# EAGLE design 246_PWM(PCA9685) (EAGLE 9.6.2)
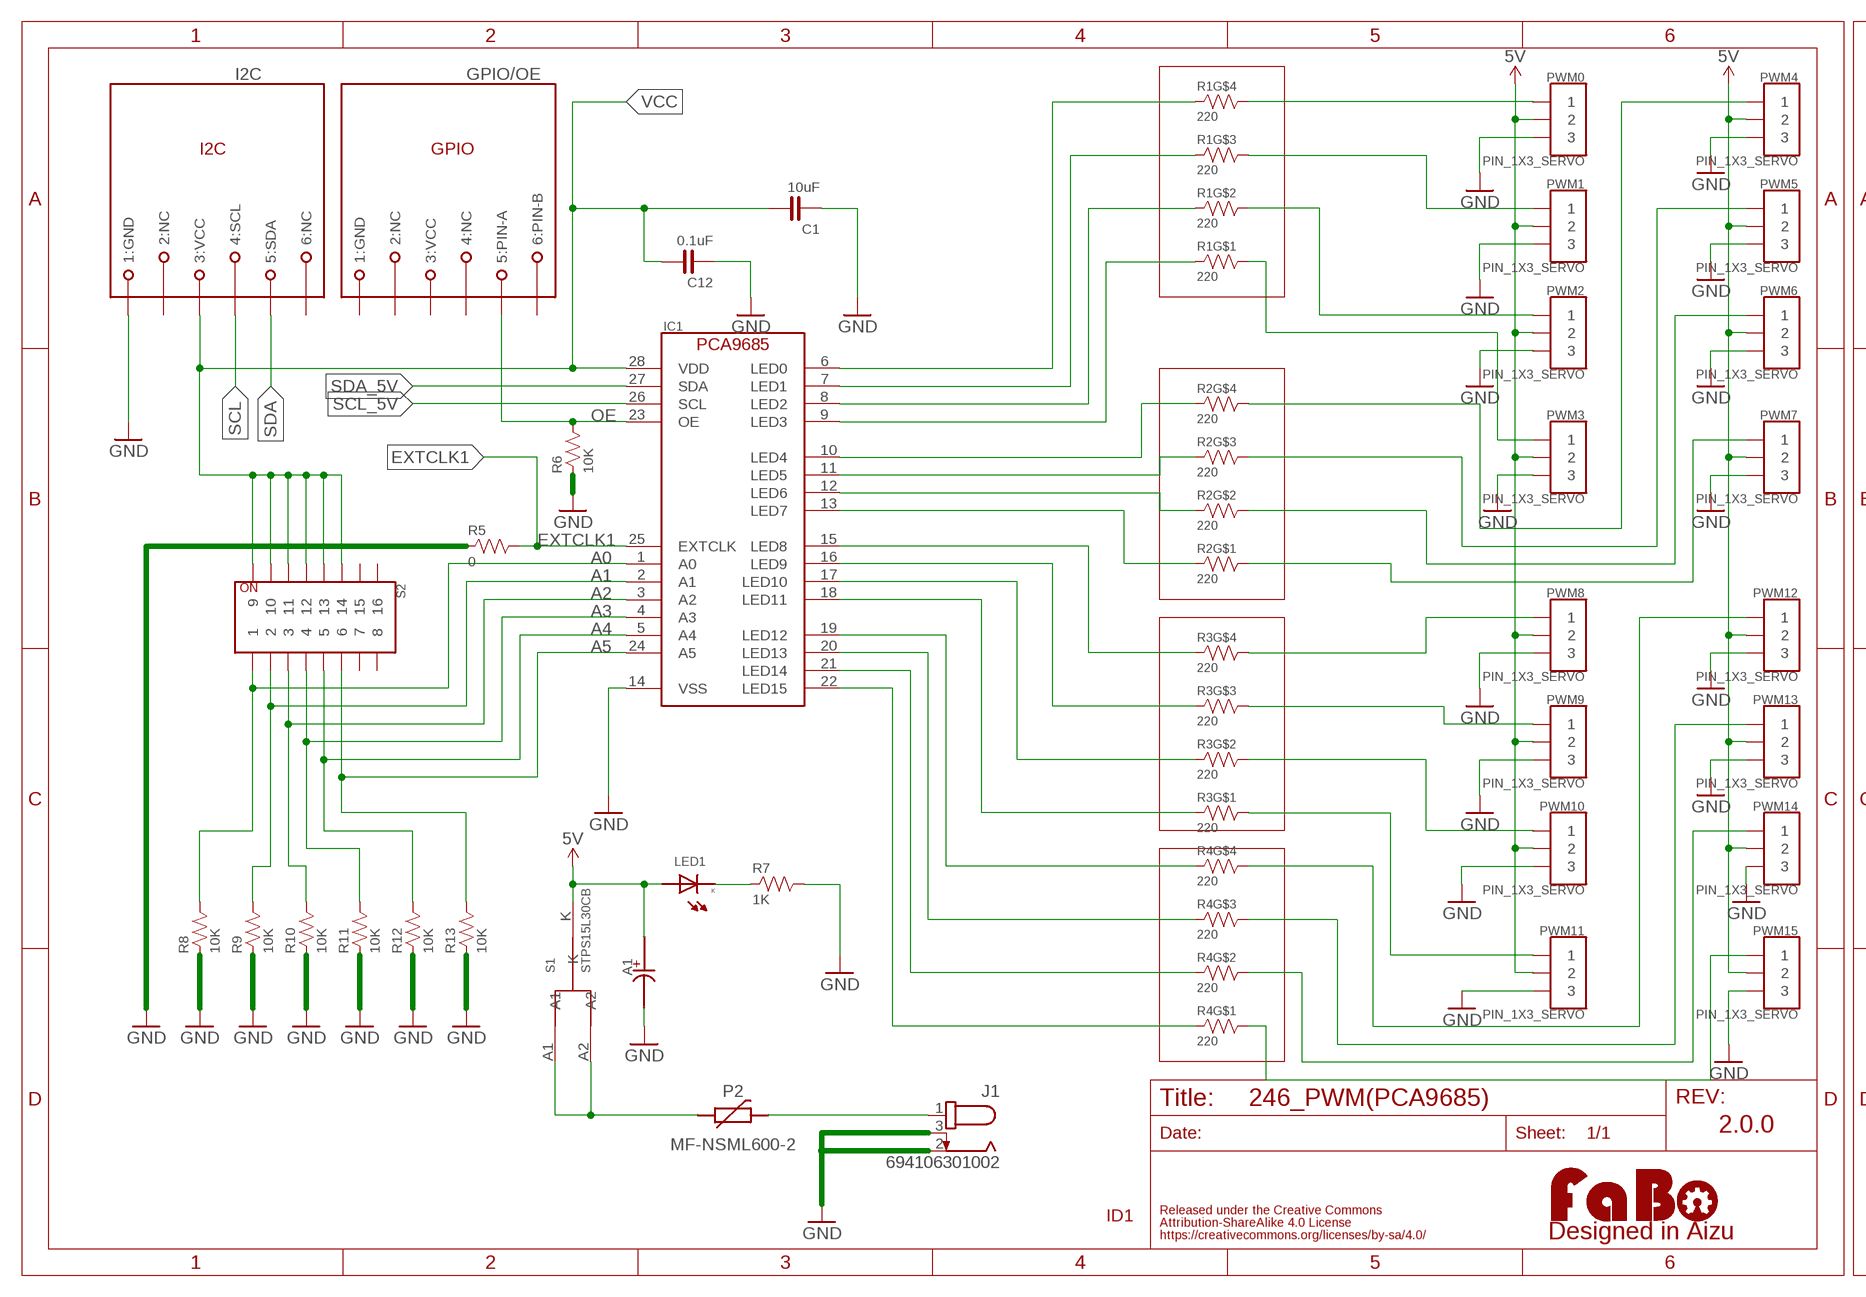
[diagram p0: schematic, sheet 1, part 1 of 2]
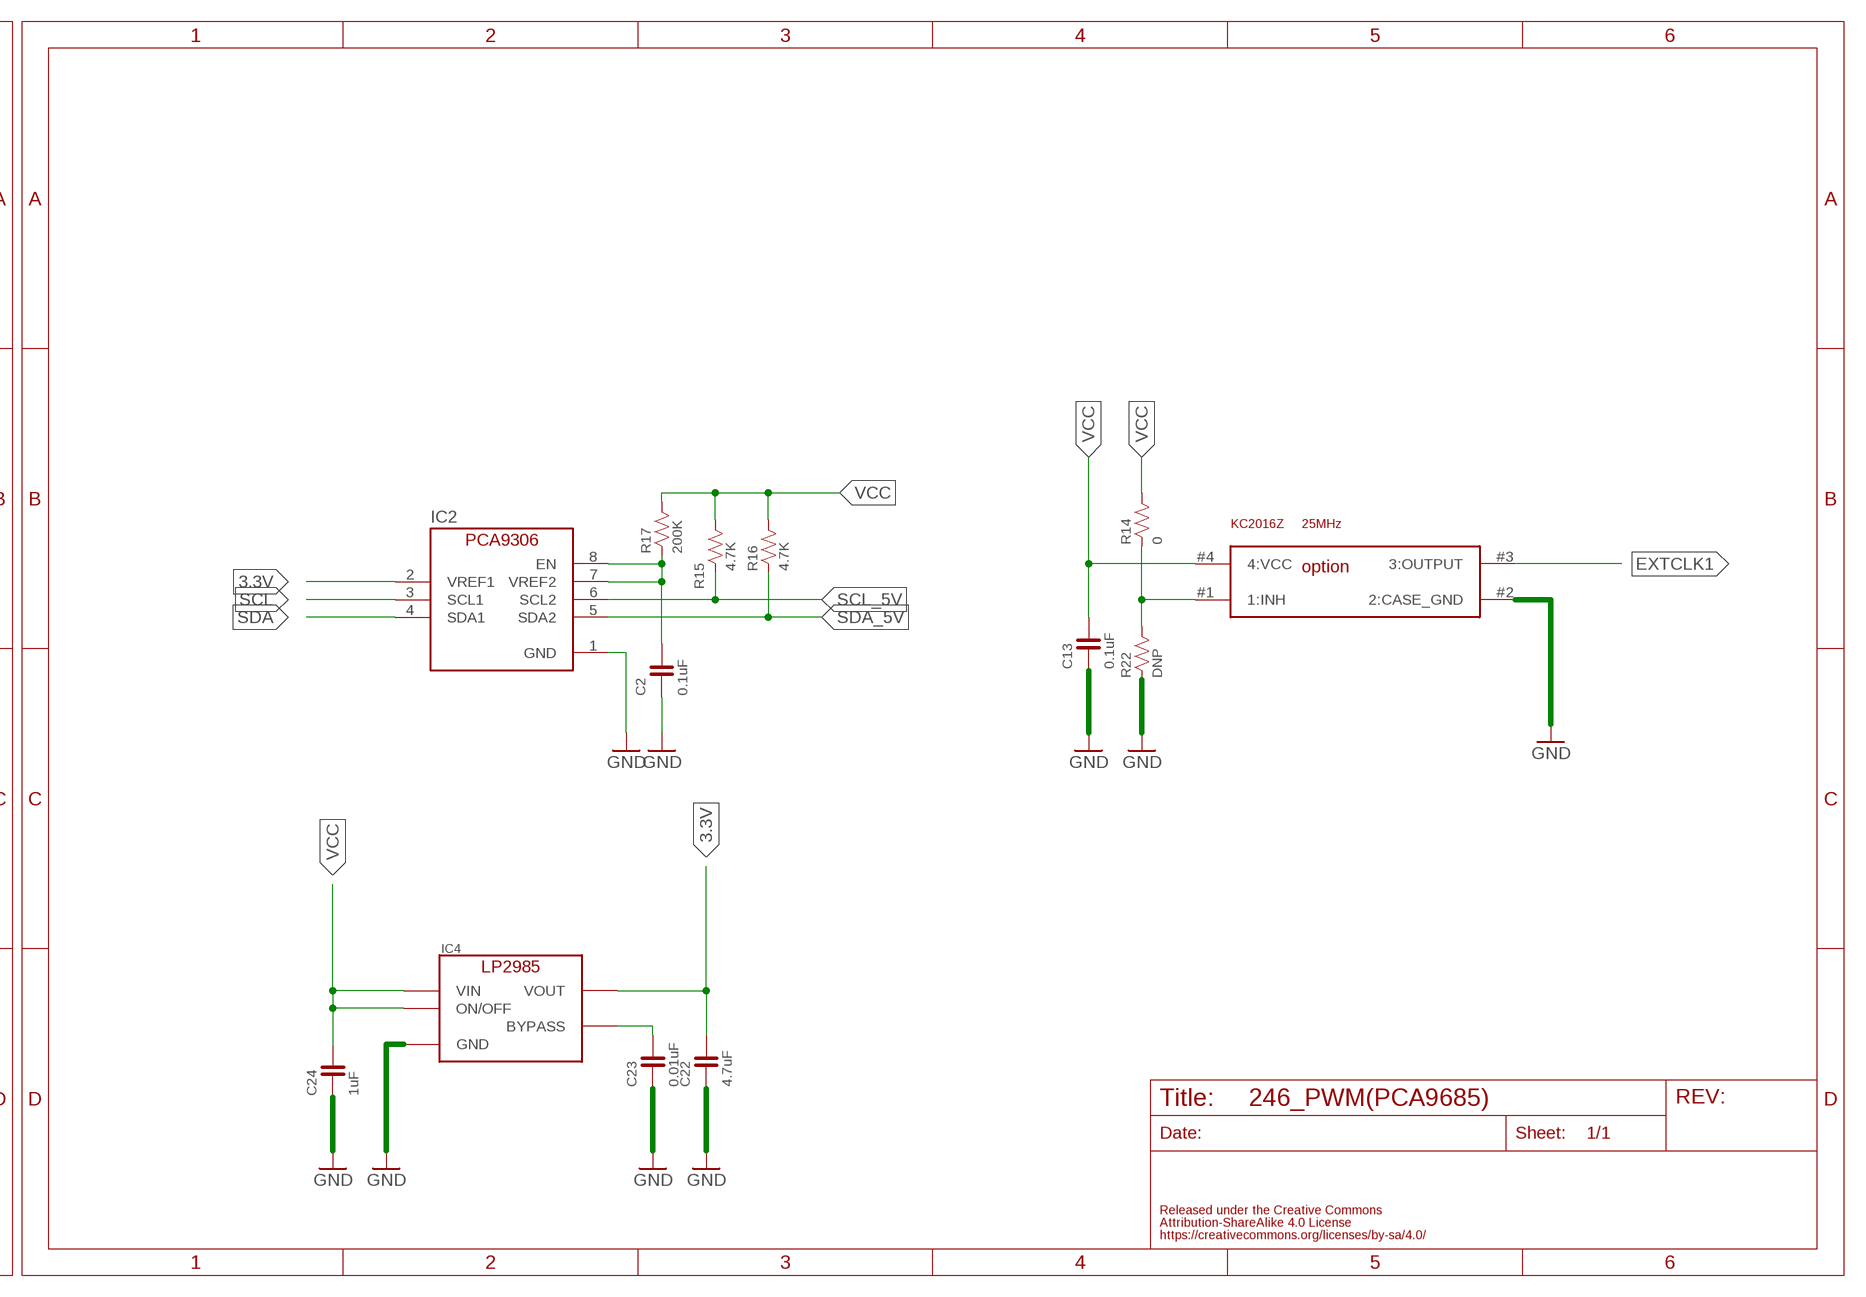
[diagram p1: schematic, sheet 1, part 2 of 2]

## Parts
A1  CAPACITOR-OS-CON  [F13]
C1  10uF  CAPACITOR-0603  [0603]
C2  0.1uF  CAPACITOR-0402  [0402]
C12  0.1uF  CAPACITOR-0603  [0603]
C13  0.1uF  CAPACITOR-0402  [0402]
C22  4.7uF  CAPACITOR-0603  [0603]
C23  0.01uF  CAPACITOR-0603  [0603]
C24  1uF  CAPACITOR-0603  [0603]
GPIO/OE  MODULAR-JACK-6P-RJ11_GPIO  [7002-6PXC-X]
I2C  MODULAR-JACK-6P-RJ11_I2C  [7002-6PXC-X]
IC1  PCA9685BS  [PCA9685]
IC2  PCA9306_GM  [XQFN8]
IC4  LP2985-33DBV  [SOT-23-5]
J1  694106301002  [694106301002]
LED1  LED-0603  [0603]
LOGO1  LOGO_FABO-M_BOTTOM  [LOGO_FABO_M_BOTTOM]
P2  MF-NSML600-2  POLYSWITCH1206  [1206]
PWM0  PIN_1X3_SERVO  [PIN_1X3_NOLABEL_PWM]
PWM1  PIN_1X3_SERVO  [PIN_1X3_NOLABEL_PWM]
PWM2  PIN_1X3_SERVO  [PIN_1X3_NOLABEL_PWM]
PWM3  PIN_1X3_SERVO  [PIN_1X3_NOLABEL_PWM]
PWM4  PIN_1X3_SERVO  [PIN_1X3_NOLABEL_PWM]
PWM5  PIN_1X3_SERVO  [PIN_1X3_NOLABEL_PWM]
PWM6  PIN_1X3_SERVO  [PIN_1X3_NOLABEL_PWM]
PWM7  PIN_1X3_SERVO  [PIN_1X3_NOLABEL_PWM]
PWM8  PIN_1X3_SERVO  [PIN_1X3_NOLABEL_PWM]
PWM9  PIN_1X3_SERVO  [PIN_1X3_NOLABEL_PWM]
PWM10  PIN_1X3_SERVO  [PIN_1X3_NOLABEL_PWM]
PWM11  PIN_1X3_SERVO  [PIN_1X3_NOLABEL_PWM]
PWM12  PIN_1X3_SERVO  [PIN_1X3_NOLABEL_PWM]
PWM13  PIN_1X3_SERVO  [PIN_1X3_NOLABEL_PWM]
PWM14  PIN_1X3_SERVO  [PIN_1X3_NOLABEL_PWM]
PWM15  PIN_1X3_SERVO  [PIN_1X3_NOLABEL_PWM]
R1  220  RESISTOR_ARRAY  [EXBV8V]
R2  220  RESISTOR_ARRAY  [EXBV8V]
R3  220  RESISTOR_ARRAY  [EXBV8V]
R4  220  RESISTOR_ARRAY  [EXBV8V]
R5  0  RESISTOR-0603  [0603]
R6  10K  RESISTOR-0603  [0603]
R7  1K  RESISTOR-0603  [0603]
R8  10K  RESISTOR-0603  [0603]
R9  10K  RESISTOR-0603  [0603]
R10  10K  RESISTOR-0603  [0603]
R11  10K  RESISTOR-0603  [0603]
R12  10K  RESISTOR-0603  [0603]
R13  10K  RESISTOR-0603  [0603]
R14  0  RESISTOR-0402  [0402]
R15  4.7K  RESISTOR-0402  [0402]
R16  4.7K  RESISTOR-0402  [0402]
R17  200K  RESISTOR-0402  [0402]
R22  DNP  RESISTOR-0402  [0402]
S1  STPS15L30CB  STPS15L30C  [STPS15L30C]
S2  KHS82  [KHS82]
U$11  KC2016Z  [KC2016Z]

## Nets
3.3V: C22.2 IC2.2(VREF1) IC4.5(VOUT)
5V: A1.ANODE(+) LED1.ANODE PWM0.2:VCC PWM1.2:VCC PWM2.2:VCC PWM3.2:VCC PWM4.2:VCC PWM5.2:VCC PWM6.2:VCC PWM7.2:VCC PWM8.2:VCC PWM9.2:VCC PWM10.2:VCC PWM11.2:VCC PWM12.2:VCC PWM13.2:VCC PWM14.2:VCC PWM15.2:VCC S1.K
A0: IC1.1(A0) R8.2 S2.1
A1: IC1.2(A1) R9.2 S2.2
A2: IC1.3(A2) R10.2 S2.3
A3: IC1.4(A3) R11.2 S2.4
A4: IC1.5(A4) R12.2 S2.5
A5: IC1.24(A5) R13.2 S2.6
EXTCLK1: IC1.25(EXTCLK) R5.2 U$11.#3(3:OUTPUT)
GND: A1.CATHODE(-) C1.1 C2.P$1 C12.1 C13.P$1 C22.1 C23.1 C24.1 I2C.1(1:GND) IC1.14(VSS) IC2.1(GND) IC4.2(GND) J1.2 J1.3 PWM0.3:GND PWM1.3:GND PWM2.3:GND PWM3.3:GND PWM4.3:GND PWM5.3:GND PWM6.3:GND PWM7.3:GND PWM8.3:GND PWM9.3:GND PWM10.3:GND PWM11.3:GND PWM12.3:GND PWM13.3:GND PWM14.3:GND PWM15.3:GND R5.1 R6.1 R7.2 R8.1 R9.1 R10.1 R11.1 R12.1 R13.1 R22.P$1 U$11.#2(2:CASE_GND)
N$1: IC1.6(LED0) R1.4
N$2: IC1.7(LED1) R1.3
N$3: IC1.8(LED2) R1.2
N$4: IC1.9(LED3) R1.1
N$5: PWM0.1:SIGNAL R1.5
N$6: PWM1.1:SIGNAL R1.6
N$7: PWM2.1:SIGNAL R1.7
N$8: PWM3.1:SIGNAL R1.8
N$9: IC1.10(LED4) R2.4
N$10: IC1.11(LED5) R2.3
N$11: IC1.12(LED6) R2.2
N$12: IC1.13(LED7) R2.1
N$13: IC1.15(LED8) R3.4
N$14: IC1.16(LED9) R3.3
N$15: IC1.17(LED10) R3.2
N$16: IC1.18(LED11) R3.1
N$17: IC1.19(LED12) R4.4
N$18: IC1.20(LED13) R4.3
N$19: IC1.21(LED14) R4.2
N$20: IC1.22(LED15) R4.1
N$21: PWM4.1:SIGNAL R2.5
N$22: PWM5.1:SIGNAL R2.6
N$23: PWM6.1:SIGNAL R2.7
N$24: PWM7.1:SIGNAL R2.8
N$25: PWM8.1:SIGNAL R3.5
N$26: PWM9.1:SIGNAL R3.6
N$27: PWM10.1:SIGNAL R3.7
N$28: PWM11.1:SIGNAL R3.8
N$29: PWM12.1:SIGNAL R4.5
N$30: PWM13.1:SIGNAL R4.6
N$31: PWM14.1:SIGNAL R4.7
N$32: PWM15.1:SIGNAL R4.8
N$33: P2.P$1 S1.A1 S1.A2
N$37: C23.2 IC4.4(BYPASS)
N$39: LED1.CATHODE R7.1
N$50: R14.P$1 R22.P$2 U$11.#1(1:INH)
OE: GPIO/OE.5(5:PIN-A) IC1.23(OE) R6.2
PTCP1: J1.1 P2.P$2
SCL: I2C.4(4:SCL) IC2.3(SCL1)
SCL_5V: IC1.26(SCL) IC2.6(SCL2) R15.P$1
SDA: I2C.5(5:SDA) IC2.4(SDA1)
SDA_5V: IC1.27(SDA) IC2.5(SDA2) R16.P$1
VCC: C1.2 C12.2 C13.P$2 C24.2 I2C.3(3:VCC) IC1.28(VDD) IC4.1(VIN) IC4.3(ON/OFF) R14.P$2 R15.P$2 R16.P$2 R17.P$2 S2.9 S2.10 S2.11 S2.12 S2.13 S2.14 U$11.#4(4:VCC)
VCC_EN: C2.P$2 IC2.7(VREF2) IC2.8(EN) R17.P$1
Unconnected: GPIO/OE.2(2:NC) GPIO/OE.4(4:NC) GPIO/OE.6(6:PIN-B) I2C.2(2:NC) I2C.6(6:NC) S2.7 S2.8 S2.15 S2.16

## Notes on the sheet
- option
- 2.0.0
- ID1

## Power pins joined to a net without a drawn wire
1:GND: GPIO/OE.1(1:GND)
3:VCC: GPIO/OE.3(3:VCC)

## Library data of the parts
A1 = FaBo-Capacitor:CAPACITOR-OS-CON: Panasonic 16SEPF1000M 16V 1000uF ESR 12 Size F13
C1 C2 C12 C13 C22-C24 = FaBo-Capacitor:CAPACITOR: CAPACITOR
GPIO/OE = FaBo-Connetor:MODULAR-JACK-6P-RJ11_GPIO
I2C = FaBo-Connetor:MODULAR-JACK-6P-RJ11_I2C
IC1 = FaBo-Motor:PCA9685BS
IC2 = FaBo-LevelTranslator:PCA9306
IC4 = FaBo-Supply:LP2985: LP2985
J1 = DC Power Jacks:694106301002: CONN PWR JACK 2.1X5.5MM SOLDER Manufacturer's datasheet <https://katalog.we-online.de/em/datasheet/6941xx301002.pdf>; CREATED_BY: PCBLayout.com; DIGIKEY_PART_NUMBER: 732-5930-ND; MANUFACTURER: Wurth Electronics Inc.; MPN: 694106301002
LED1 = FaBo-LED:LED
LOGO1 = component:LOGO_FABO
P2 = FaBo-Supply:POLYSWITCH
PWM0 PWM1-PWM15 = FaBo-PIN:PIN_1X3_SERVO
R1-R4 = component:RESISTOR_ARRAY
R5-R17 R22 = FaBo-Resistors:RESISTOR: RESISTOR
S1 = FaBo-Supply:STPS15L30C
S2 = FaBo-Switch:KHS82
U$11 = FaBo-Crystal:KC2016Z

## Board
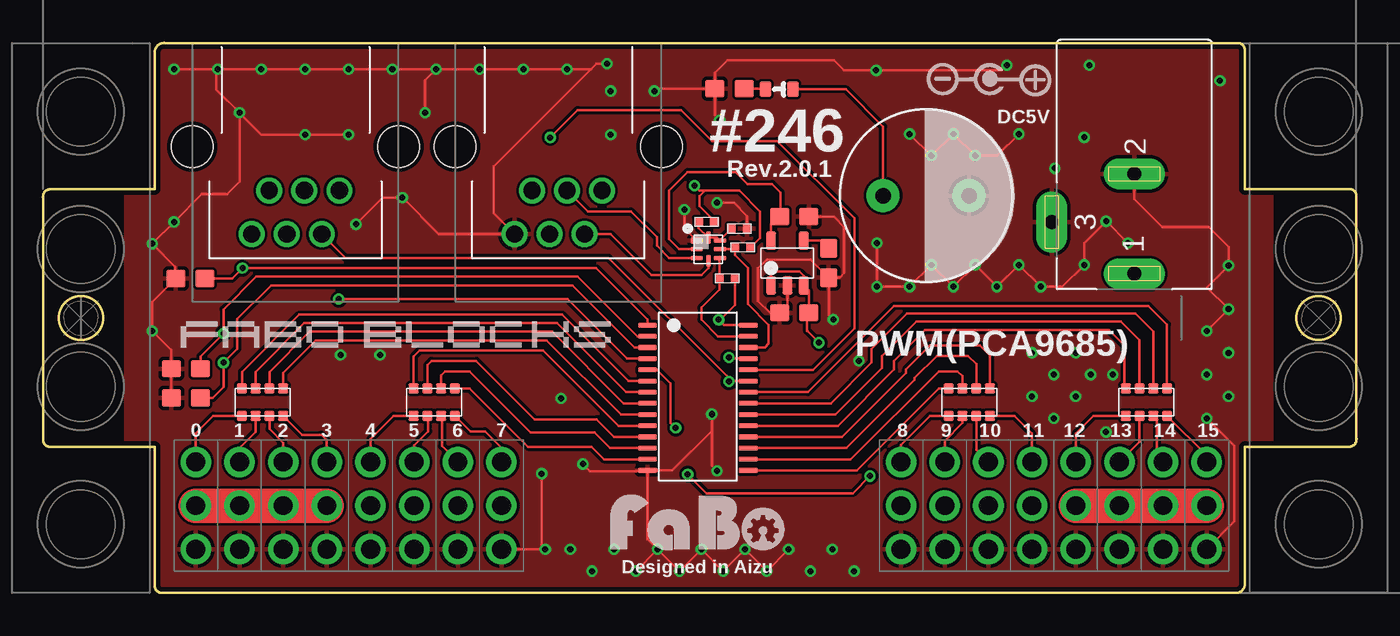
[diagram p2: board, top side]
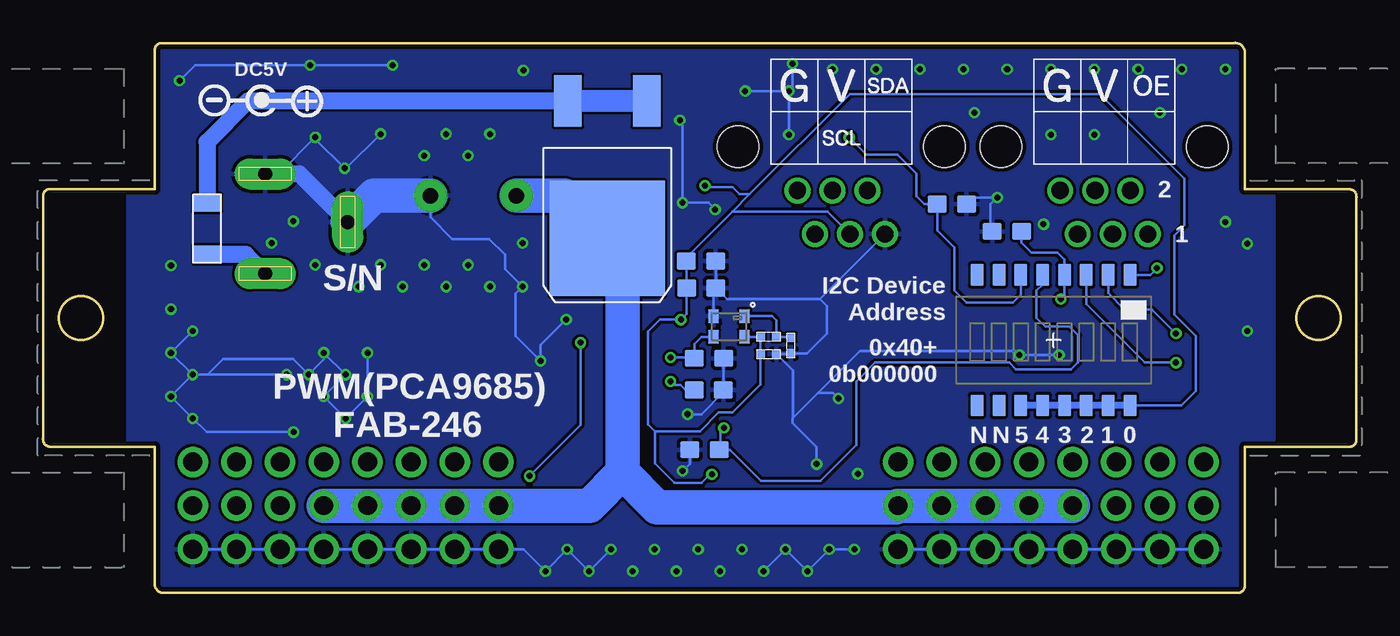
[diagram p3: board, bottom side, seen from below]

Size 76.41 x 32 mm. Coordinates in mm from the lower left corner, seen from the top.
Outline: 7.1,32 69.5,32 arc-90 69.9,31.6 69.9,23.5 76,23.5 arc-90 76.4,23.1 76.4,9 arc-90 76,8.5 69.9,8.5 69.9,0.5 arc-90 69.4,0 6.9,0 arc-90 6.5,0.4 6.5,8.5 0.4,8.5 arc-90 0,8.9 0,23 arc-90 0.4,23.5 6.5,23.5 6.5,31.5 arc-90 7.1,32
Outline: circle at 74.2,16 radius 1.27
Outline: circle at 2.2,16 radius 1.27
Copper layers (1*16): Top 0.035mm / dielectric 1.6mm / Bottom 0.035mm
Design rules "PCBway": minimum track width 6mil, minimum drill 12mil, track to track 6mil, track to pad 6mil, pad to pad 6mil, via to via 6mil, smd to smd 6mil, copper to edge 10mil, drill to drill 10mil, minimum pad ring 10mil, minimum via ring 6mil, stop-mask expansion 2mil, vias tented up to drill 100mil, thermal gap 8mil
tRestrict: area -1.2,7.3 to 4.7,24.4; area 71.6,7.5 to 77.5,24.6
bRestrict: area -1.2,7.3 to 4.7,24.4; area 71.6,7.6 to 77.5,24.7

### Footprints (pad centres in the part's own frame; a part is rotated, then mirrored left to right if it is on the bottom)
F13 = drill 0.9 pad 1.93: ANODE -2.5,0; CATHODE 2.5,0
0603 = smd 1.1 x 1: 1 -0.85,0; 2 0.85,0
0402 = smd 0.5 x 0.5: P$1 -0.46,0; P$2 0.46,0
7002-6PXC-X = drill 1: 1 2.55,5.08; 2 1.53,2.54; 3 0.51,5.08; 4 -0.51,2.54; 5 -1.53,5.08; 6 -2.55,2.54 | hole 2.4: -6,0; 6,0
PCA9685 = smd 0.3 x 1.1: 1 -4.15,-2.93; 2 -3.5,-2.93; 3 -2.85,-2.93; 4 -2.2,-2.93; 5 -1.55,-2.93; 6 -0.9,-2.93; 7 -0.25,-2.93; 8 0.4,-2.93; 9 1.05,-2.93; 10 1.7,-2.93; 11 2.35,-2.93; 12 3,-2.93; 13 3.65,-2.93; 14 4.3,-2.93; 15 4.3,2.92; 16 3.65,2.92; 17 3,2.92; 18 2.35,2.92; 19 1.7,2.92; 20 1.05,2.92; 21 0.4,2.92; 22 -0.25,2.92; 23 -0.9,2.92; 24 -1.55,2.92; 25 -2.2,2.92; 26 -2.85,2.92; 27 -3.5,2.92; 28 -4.15,2.92
XQFN8 = smd 0.7 x 0.35: 1 -0.675,0.5 | smd 0.7 x 0.25: 2 -0.675,0; 3 -0.675,-0.5; 5 0.675,-0.5; 6 0.675,0; 7 0.675,0.5 | smd 0.25 x 0.7: 4 0,-0.675; 8 0,0.675
SOT-23-5 = smd 0.6 x 1.05: 1 -0.95,-1.3; 2 0,-1.3; 3 0.95,-1.3; 4 0.95,1.3; 5 -0.95,1.3
694106301002 = drill 0.8 pad 1.8 long: 1 13.6,0; 2 7.8,0; 3 10.6,-4.8
0603' = smd 0.65 x 0.9: ANODE -0.8,0; CATHODE 0.8,0
1206 = smd 1 x 1.6: P$1 -1.5,0; P$2 1.5,0
PIN_1X3_NOLABEL_PWM = drill 1.1 pad 1.778: 1:SIGNAL 0,2.54; 2:VCC 0,0; 3:GND 0,-2.54
EXBV8V = smd 0.6 x 0.6: 1 -1.2,-0.8; 2 -0.4,-0.8; 3 0.4,-0.8; 4 1.2,-0.8; 5 1.2,0.8; 6 0.4,0.8; 7 -0.4,0.8; 8 -1.2,0.8
STPS15L30C = smd 1.6 x 3: A1 -2.286,-6.13; A2 2.286,-6.13 | smd 6.7 x 6.7: K 0,1.87
KHS82 = smd 0.76 x 1.27: 1 -4.445,-3.8; 2 -3.175,-3.8; 3 -1.905,-3.8; 4 -0.635,-3.8; 5 0.635,-3.8; 6 1.905,-3.8; 7 3.175,-3.8; 8 4.445,-3.8; 9 -4.445,3.8; 10 -3.175,3.8; 11 -1.905,3.8; 12 -0.635,3.8; 13 0.635,3.8; 14 1.905,3.8; 15 3.175,3.8; 16 4.445,3.8
KC2016Z = smd 0.6 x 0.8: #1 -0.9,-0.6; #2 0.9,-0.6; #3 0.9,0.6; #4 -0.9,0.6

### Placement (x,y rotation side)
A1  51.36,23.12 0 top
C1  38.13,19.31 180 bottom
C2  40.5,21.2 180 top
C12  38.11,17.74 180 bottom
C13  34.2,13.9 180 bottom
C22  43.7,21.9 180 top
C23  45.7,19.2 90 top
C24  43.7,16.3 0 top
GPIO/OE  14.69,25.96 180 top
I2C  29.97,25.96 180 top
IC1  38.09,11.43 270 top
IC2  38.7,20 0 top
IC4  43.3,19.2 0 top
J1  63.48,32.18 270 top
LED1  [0603']  42.83,29.31 180 top
LOGO1  38.07,2.1 0 bottom
P2  66.86,21.2 270 bottom
PWM0  8.89,5.08 0 top
PWM1  11.43,5.08 0 top
PWM2  13.97,5.08 0 top
PWM3  16.51,5.08 0 top
PWM4  19.05,5.08 0 top
PWM5  21.59,5.08 0 top
PWM6  24.13,5.08 0 top
PWM7  26.67,5.08 0 top
PWM8  49.91,5.08 0 top
PWM9  52.45,5.08 0 top
PWM10  54.99,5.08 0 top
PWM11  57.53,5.08 0 top
PWM12  60.07,5.08 0 top
PWM13  62.61,5.08 0 top
PWM14  65.15,5.08 0 top
PWM15  67.69,5.08 0 top
R1  12.77,11.1 180 top
R2  22.76,11.1 180 top
R3  53.88,11.1 180 top
R4  64.18,11.1 180 top
R5  37.66,13.65 180 bottom
R6  37.67,11.81 180 bottom
R7  39.93,29.34 180 top
R8  8.58,18.29 0 top
R9  8.32,13.04 0 top
R10  8.32,11.34 0 top
R11  20.33,21.04 0 bottom
R12  37.93,8.33 0 bottom
R13  23.53,22.62 180 bottom
R14  34.2,14.9 180 bottom
R15  40.7,20.1 0 top
R16  39.8,18.3 0 top
R17  38.6,21.6 0 top
R22  32.9,14.4 90 bottom
S1  43.58,22.5 180 bottom
S2  17.62,14.71 180 bottom
U$2  [4-1BLOCK]  2.2,16 0 top
U$4  [4-1BLOCK]  74.2,16 180 top
U$11  36.5,15.5 180 bottom

### Tracks (layer width: path | path; a pad name or v marks a point on that pad's centre or on a via)
3.3V
  Top 0.152: IC2.2 37,20 36.4,20.6 36.4,23.4 37.5,24.5 40.27,24.5 40.98,23.8 42.41,23.8 42.9,23.3 42.9,22 | 42.9,22 42.9,21.95 C22.2 | IC4.5 42.35,21.45 42.9,22
5V
  Top 0.152: A1.ANODE 48.86,27.14 46.69,29.31 LED1.ANODE
  Top 2: PWM0.2:VCC PWM1.2:VCC PWM2.2:VCC PWM3.2:VCC | PWM12.2:VCC PWM13.2:VCC PWM14.2:VCC PWM15.2:VCC
  Bottom 2: 42.7,7 40.68,4.98 26.77,4.98 PWM7.2:VCC PWM6.2:VCC PWM5.2:VCC PWM4.2:VCC PWM3.2:VCC | PWM12.2:VCC PWM11.2:VCC PWM10.2:VCC PWM9.2:VCC PWM8.2:VCC 44.62,5.08 42.7,7 | 42.7,7 42.7,19.75 S1.K 46.07,23.12 A1.ANODE
A0  (via drill 0.35)
  Top 0.152: IC1.1 35.16,15.91 32.17,18.9 v11.6,18.9 10.99,18.29 R8.2 9.45,18.31
  Bottom 0.152: S2.1 12,18.5 v11.6,18.9
A1  (via drill 0.35)
  Top 0.152: IC1.2 34.57,14.93 31.1,18.4 12.4,18.4 10.5,16.5 v10.5,15.1 9.17,13.76 R9.2
  Bottom 0.152: v10.5,15.1 11.89,16.49 13.49,16.49 14.45,17.45 S2.2
A2  (via drill 0.35)
  Top 0.152: IC1.3 34.42,14.28 30.8,17.9 13.27,17.9 11.3,15.93 11.3,14.2 v10.5,13.4 10.5,11.97 9.87,11.34 R10.2
  Bottom 0.152: v10.5,13.4 12.3,13.4 15.72,16.82 S2.3
A3  (via drill 0.35)
  Top 0.152: IC1.4 33.97,13.63 30.5,17.1 v17.2,17.1
  Bottom 0.152: R11.2 19.48,20.38 18.9,19.8 17.4,19.8 16.99,19.39 S2.4 16.99,17.32 v17.2,17.1
A4  (via drill 0.35)
  Top 0.152: IC1.5 35.72,12.98 36.5,12.2 36.5,9.9 v36.8,9.6
  Bottom 0.152: 37,8.33 36.43,8.33 34.63,6.52 31.18,6.52 29.1,8.6 29.1,12.3 28,13.4 20.2,13.4 19.8,13 16.6,13 16.2,13.4 16.2,15 16.7,15.5 18.1,15.5 18.61,16.01 18.61,17.59 18.26,17.95 S2.5 | 37,8.33 R12.2 | v36.8,9.6 37,9.4 37,8.33
A5  (via drill 0.35)
  Top 0.152: v29.5,26.5 31.1,28.1 37.1,28.1 38.9,26.3 42.7,26.3 47.2,21.8 47.2,15.4 44.78,12.98 IC1.24
  Bottom 0.152: v29.5,26.5 28.5,25.5 26.7,25.5 25.6,24.4 25.6,23.1 25.12,22.62 R13.2 24.38,21.08 23.4,20.1 23.4,17.6 22.7,16.9 20,16.9 19.53,17.38 S2.6
EXTCLK1  (via drill 0.35)
  Top 0.152: IC1.25 39.97,13.63 v39.9,13.7
  Bottom 0.152: U$11.#3 37.5,14.8 37.6,14.9 38.1,14.9 38.51,14.49 R5.2 38.56,13.7 v39.9,13.7
GND  (via drill 0.35)
  Top 0.152: 31.88,30.48 26.2,24.8 26.2,22.1 I2C.1 23.02,20.88 v20.91,22.99 | v32.8,30.8 32.2,30.8 31.88,30.48 | IC1.14 36.6,7.13 38.9,9.43 | v20.9,23 v20.91,22.99 | PWM7.3:GND v29.21,2.54 29.01,2.74 v29.01,6.94 29.11,6.84 | IC1.14 35.16,3.13 35.71,2.58 | 35.71,2.58 v35.75,2.54 v37.02,1.27 v38.29,2.54 v39.56,1.27 v40.83,2.54 v42.1,1.27 v43.37,2.54 | v7.62,30.48 10.08,30.48 | 10.08,30.48 v10.16,30.48 v12.7,30.48 v15.24,30.48 v17.78,30.48 v20.32,30.48 v22.86,30.48 | v22.86,30.48 v25.4,30.48 v27.94,30.48 v30.48,30.48 31.88,30.48 | 10.08,30.48 10.08,29.29 v11.43,27.94 11.45,27.93 | 11.45,27.93 12.7,26.67 v15.24,26.67 v17.78,26.67 | 11.45,27.93 11.45,23.93 10.72,23.2 9.23,23.2 v7.62,21.59 v6.35,20.32 7.7,18.98 7.7,18.26 | v34.48,1.27 35.71,2.5 35.71,2.58 | v18.2,21.45 19.74,22.99 v20.91,22.99 | IC1.14 35.13,7.1 34.5,7.1 34.48,7.08 31.82,7.08 v31.4,7.5 | v67.69,15.24 v68.96,16.51 67.69,17.78 v68.96,19.05 68.96,20.14 67.8,21.3 65.1,21.3 63.48,22.92 J1.2 | v38.9,10.4 38.9,9.43 | v39.2,7.1 38.9,7.4 38.9,9.43 | R10.1 R9.1 7.47,14.13 v6.35,15.24 6.35,16.91 7.7,18.26 | PWM15.3:GND 69.3,4.15 69.3,8.55 v67.69,10.16 | v35.56,29.21 35.69,29.34 R7.2 | R7.2 39.08,27.79 v39.36,27.51 | R7.2 39.08,30.28 39.8,31 46,31 46.59,30.41 v48.46,30.41 55.76,30.41 v56.06,30.71 | IC4.2 43.3,16.6 43,16.3 C24.1 42.3,16.3 41.6,17 41.6,18.9 42.1,19.4 44.65,19.4 C23.1 45.72,18.35 | 45.72,18.35 46.35,18.35 46.6,18.6 46.6,21.3 46,21.9 C22.1 | C2.P$1 40.96,21.94 40.2,22.7 v39.2,22.7 | IC2.1 38,20.5 37.3,21.2 v37.3,22.3 | v63.11,20.36 v61.84,21.63 60.57,20.36 v60.57,19.09 59.3,17.82 v58.03,17.82 v56.76,19.09 v55.49,17.82 v54.22,19.09 v52.95,17.82 v51.68,19.09 v50.41,17.82 v48.51,17.82 v48.51,20.36
  Top 0.152: v22.23,27.94 22.23,29.84 v22.86,30.48 | v50.41,26.71 v51.68,25.44 v52.95,26.71 v54.22,25.44 55.49,25.44 v56.76,26.71 | v45.97,15.91 45.72,16.16 45.72,18.35 | 7.7,18.26 R8.1
  Bottom 0.152: PWM15.3:GND PWM14.3:GND PWM13.3:GND PWM12.3:GND PWM11.3:GND PWM10.3:GND PWM9.3:GND PWM8.3:GND 48.45,2.54 v47.18,1.27 v45.91,2.54 v44.64,1.27 v43.37,2.54 | PWM0.3:GND PWM1.3:GND PWM2.3:GND PWM3.3:GND PWM4.3:GND PWM5.3:GND PWM6.3:GND PWM7.3:GND | 31.2,17.1 I2C.1 | v17.3,13.85 v19.6,13.85 19.83,14.08 28.88,14.08 31.33,11.64 | 31.33,11.64 32.78,10.18 | 32.78,10.18 32.8,10.16 32.8,9.9 31.4,8.5 v31.4,7.5 | v67.69,15.24 v68.96,13.97 v67.69,12.7 | v61.83,9.36 66.89,9.36 v67.69,10.16 v68.96,11.43 v67.69,12.7 | v67.69,12.7 v62.23,12.7 | v67.69,12.7 66.82,12.7 65.92,13.6 61.84,13.6 v60.94,12.7 60.07,13.57 v60.07,13.97 v58.8,12.7 v60.07,11.43 v58.8,10.16 v57.53,11.43 v57.53,13.97 | v33.02,29.21 v35.56,29.21 | v33.02,29.21 v33.02,26.67 | v33.02,29.21 32.8,29.43 v32.8,30.8 | v38.9,10.4 38.1,10.4 36.82,11.68 R6.1 R5.1 | R12.1 38.78,7.52 v39.2,7.1 | 31.2,17.1 30.8,16.7 30.8,15.1 31.96,13.94 R22.P$1 32.94,13.9 C13.P$1 32.78,12.94 32.78,10.18 | 37.21,17.69 36.62,17.1 31.2,17.1 | 37.21,17.69 C12.1 | C12.1 37.26,19.29 C1.1 | 37.4,17.5 37.21,17.69 | C12.1 37.4,17.6 U$11.#2 | R11.1 21.28,21.14 21.28,22.62 v20.9,23 22.3,23 R13.1 | A1.CATHODE 53.86,21.86 52.6,20.6 50.45,20.6 49.53,19.68 49.53,18.84 v48.51,17.82 48.9,17.43 48.9,14.95 v47.46,13.51 47.46,14.42 v45.97,15.91 | v39.36,27.51 39.2,27.35 v39.2,22.7 37.7,22.7 v37.3,22.3 | v56.06,30.71 v60.86,30.71 67.56,30.71 v68.46,29.81 | v56.76,26.71 58.76,24.71 v58.86,24.71 60.56,26.41 v60.56,26.51 62.69,24.38 J1.2 | v29.21,2.54 v30.67,2.54 v31.94,1.27 v33.21,2.54 v34.48,1.27 | v30.13,11.31 30.46,11.64 31.33,11.64
  Bottom 1: J1.3 61.48,24.38 J1.2
  Bottom 2: A1.CATHODE 57.14,23.12 J1.3
  pour Bottom (rank 6): -4.48,-1.83 80.84,-1.83 80.84,34.63 -4.48,34.63
  pour Top (rank 6): -4.12,-1.1 79.41,-1.1 79.41,33.7 -4.12,33.7
N$1
  Top 0.152: IC1.6 34.07,12.33 30.2,16.2 14.9,16.2 11.57,12.87 R1.4
N$2
  Top 0.152: IC1.7 33.92,11.68 29.91,15.7 15.2,15.7 12.37,12.87 R1.3
N$3
  Top 0.152: R1.2 13.17,12.87 15.5,15.2 29.6,15.2 33.77,11.03 IC1.8
N$4
  Top 0.152: IC1.9 33.62,10.38 29.3,14.7 15.87,14.7 13.97,12.8 R1.1
N$5
  Top 0.152: PWM0.1:SIGNAL 8.89,9.29 9.9,10.3 R1.5
N$6
  Top 0.152: R1.6 12.37,9.37 11.43,8.43 PWM1.1:SIGNAL
N$7
  Top 0.152: R1.7 13.17,9.53 13.97,8.73 PWM2.1:SIGNAL
N$8
  Top 0.152: R1.8 15.07,9.2 16.2,9.2 16.51,8.89 PWM3.1:SIGNAL
N$9
  Top 0.152: IC1.10 33.47,9.73 29.1,14.1 21.9,14.1 21.56,13.76 R2.4
N$10
  Top 0.152: R2.3 22.36,13.26 22.6,13.5 25.2,13.5 28.6,10.1 32.2,10.1 33.22,9.08 IC1.11
N$11
  Top 0.152: R2.2 23.16,12.66 23.4,12.9 24.8,12.9 28.37,9.33 32.07,9.33 32.97,8.43 IC1.12
N$12
  Top 0.152: R2.1 24.8,11.9 28.2,8.5 31.9,8.5 32.62,7.78 IC1.13
N$13
  Top 0.152: IC1.15 47.33,7.13 52.1,11.9 R3.4
N$14
  Top 0.152: IC1.16 46.98,7.78 52.1,12.9 53.2,12.9 53.48,12.62 R3.3
N$15
  Top 0.152: IC1.17 46.73,8.43 50.7,12.4 50.7,12.5 52,13.8 53.8,13.8 54.28,13.32 R3.2
N$16
  Top 0.152: IC1.18 46.48,9.08 50.2,12.8 50.2,13 51.6,14.4 54.5,14.4 55.08,13.82 R3.1
N$17
  Top 0.152: IC1.19 46.23,9.73 49.5,13 49.5,13.5 51.3,15.3 62,15.3 62.9,14.4 62.9,11.98 R4.4
N$18
  Top 0.152: R4.3 63.78,14.72 62.7,15.8 50.8,15.8 48.8,13.8 48.8,13.1 46.08,10.38 IC1.20
N$19
  Top 0.152: R4.2 64.58,15.22 63.55,16.25 50.25,16.25 48.2,14.2 48.2,13.4 45.83,11.03 IC1.21
N$20
  Top 0.152: IC1.22 44.48,11.68 49.5,16.7 64.3,16.7 65.38,15.62 R4.1
N$21
  Top 0.152: PWM4.1:SIGNAL 19.05,8.95 20.4,10.3 R2.5
N$22
  Top 0.152: PWM5.1:SIGNAL 21.59,8.59 22.4,9.4 22.4,10.26 R2.6
N$23
  Top 0.152: R2.7 23.2,10.26 23.2,8.55 PWM6.1:SIGNAL
N$24
  Top 0.152: R2.8 24.86,9.4 25.7,9.4 26.67,8.43 PWM7.1:SIGNAL
N$25
  Top 0.152: PWM8.1:SIGNAL 49.91,8.61 51.6,10.3 R3.5
N$26
  Top 0.152: R3.6 53.48,9.88 52.45,8.85 PWM9.1:SIGNAL
N$27
  Top 0.152: R3.7 54.28,8.33 PWM10.1:SIGNAL
N$28
  Top 0.152: R3.8 56.5,10.3 57.53,9.27 PWM11.1:SIGNAL
N$29
  Top 0.152: R4.5 61.1,10.3 60.07,9.27 PWM12.1:SIGNAL
N$30
  Top 0.152: PWM13.1:SIGNAL 63.78,8.79 R4.6
N$31
  Top 0.152: R4.7 64.8,10.08 64.8,7.97 PWM14.1:SIGNAL
N$32
  Top 0.152: R4.8 67.69,7.99 PWM15.1:SIGNAL
N$33
  Bottom 1: P2.P$1 66.86,26.24 64.47,28.63 44.9,28.63
  Bottom 1.27: S1.A2 44.9,28.63 S1.A1
N$37
  Top 0.152: C23.2 45.25,20.5 IC4.4
N$39
  Top 0.152: R7.1 42,29.34 LED1.CATHODE
N$50
  Bottom 0.152: U$11.#1 34,16.1 33.74,15.84 R14.P$1 32.94,14.9 R22.P$2
OE  (via drill 0.35)
  Top 0.152: IC1.23 39.93,12.33 v39.9,12.3 39.9,12.5 32.9,19.5 17.6,19.5 GPIO/OE.5
  Bottom 0.152: R6.2 39.02,11.81 39.31,12.1 39.7,12.1 v39.9,12.3
PTCP1
  Bottom 1: J1.1 64.6,19.7 P2.P$2
SCL
  Top 0.152: I2C.4 31.7,22.2 34.2,22.2 35.7,20.7 35.7,20.2 36.4,19.5 IC2.3
SCL_5V
  Top 0.152: IC2.6 40.14,20 R15.P$1 40.24,19.66 41,18.9 41,16.8 42.2,15.6 42.2,14.5 41.98,14.28 IC1.26
SDA
  Top 0.152: I2C.5 33.02,20.88 35.4,18.5 38.3,18.5 38.7,18.9 IC2.4
SDA_5V
  Top 0.152: IC2.5 39.34,19.46 R16.P$1 39.34,17.64 38.3,16.6 38.3,15.9 39.27,14.93 IC1.27
VCC  (via drill 0.35)
  Top 0.152: IC1.28 39.62,15.58 39.35,15.85 | 39.35,15.85 v39.3,15.9 | R17.P$2 39.1,21.6 38.2,22.5 38.2,23.1 38.5,23.4 | IC4.1 42.35,18.55 42.5,18.7 44,18.7 44.25,18.45 IC4.3 44.55,17.6 C24.2 44.45,16.2 44.45,15.24 44.46,15.24 v45.14,14.56 | R15.P$2 41.7,20.64 41.7,22.2 40.5,23.4 38.5,23.4 | R16.P$2 40.26,16.76 39.35,15.85 | v48.1,6.8 47.1,5.8 38.6,5.8 v37.5,6.9 | 38.5,23.4 38.2,23.4 v37.9,23.7
  Bottom 0.152: 36.3,22.2 38.98,19.52 C1.2 38.96,19.29 C12.2 38.96,16.24 v39.3,15.9 40.5,15.9 41.2,15.2 41.2,9.8 40.8,9.4 | 36.3,22.2 35.3,23.2 | 35.3,23.2 29.47,29.04 14.94,29.04 10,24.1 10,21.4 10.6,20.8 10.6,16.2 9.35,14.95 9.35,11.75 10.2,10.9 S2.9 | I2C.3 30.78,22.2 36.3,22.2 | U$11.#4 R14.P$2 C13.P$2 34.66,12.14 36.3,10.5 37.1,10.5 38.2,9.4 40.8,9.4 | v45.14,14.56 45.14,9.77 v48.1,6.8 | v37.5,6.9 37.6,6.9 38.1,6.4 39.66,6.4 40.8,7.54 40.8,9.4 | v37.9,23.7 37.8,23.6 36.3,23.6 35.9,23.2 35.3,23.2
  Bottom 0.406: S2.9 S2.10 S2.11 S2.12 S2.13 S2.14
VCC_EN
  Top 0.152: R17.P$1 38.14,21.23 IC2.8 39.2,20.68 IC2.7 39.38,20.54 C2.P$2

### Text on the board
tPlace: DC5V | #246 | Rev.2.0.1 | PWM(PCA9685) | 0 | 1 | 2 | 3 | 4 | 5 | 6 | 7 | 8 | 9 | 10 | 11 | 12 | 13 | 14 | 15 | Designed in Aizu
bPlace: DC5V | 2 | 1 | I2C Device / Address | S/N | 0x40+ / 0b000000 | PWM(PCA9685) | FAB-246 | 0 | 1 | 2 | 3 | 4 | 5 | N | N
tDocu: 2 | 1 | #246 PWM(PCA9685) Rev2.0.1 / 2022/08/30 ID2